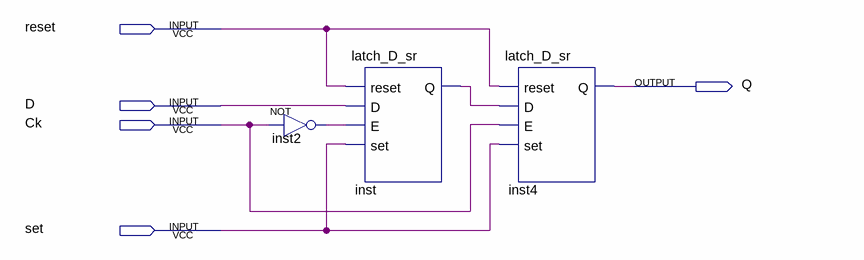
[diagram p0: schematic sheet]
// Quartus schematic flip_flop_sr.bdf as structural Verilog: 3 symbols, 5 pins
module flip_flop_sr (
  input  reset,
  input  D,
  input  Ck,
  input  set,
  output Q
);

  wire inst2_out, inst_q;

  not inst2 (inst2_out, Ck);
  latch_D_sr inst (.reset(reset), .D(D), .E(inst2_out), .set(set), .Q(inst_q));
  latch_D_sr inst4 (.reset(reset), .D(inst_q), .E(Ck), .set(set), .Q(Q));
endmodule
